# Altium schematic sheet CANInterface.SchDoc
size A4; SheetNumber: 3; SheetTotal: 9
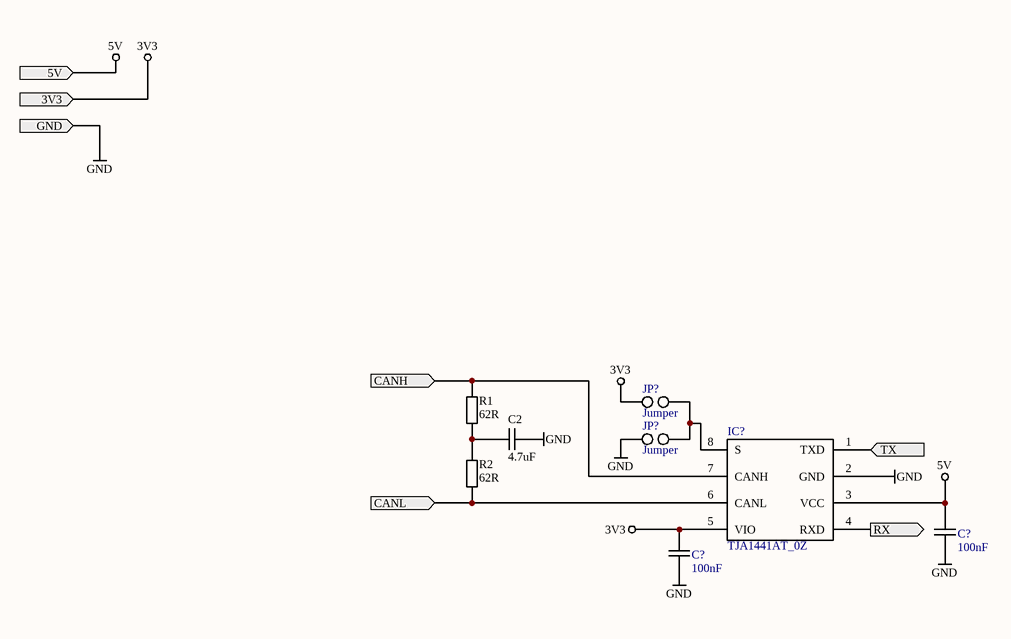
[diagram p0: CANInterface.SchDoc]

## Parts
(Parts that share a designator on the sheet are numbered #1, #2 ... from top to bottom, then left to right.)
C2  4.7uF  [C_1210]
C?#1  100nF  [C_0402]
C?#2  100nF  [C_0402]
IC?  TJA1441AT_0Z  [SOIC127P600X175-8N]
JP?#1  Jumper  [7731111802LF]
JP?#2  Jumper  [7731111802LF]
R1  62R  [R_1210]
R2  62R  [R_1210]

## Ports
3V3 (in), 5V (in), CANH (in), CANL (in), GND (in), RX (out), TX (in)

## Nets
3V3: C?#2.2 IC?.5(VIO) JP?#1.1 ; port 3V3
5V: C?#1.2 IC?.3(VCC) ; port 5V
GND: C2.2 C?#1.1 C?#2.1 IC?.2(GND) JP?#2.2 ; port GND
CANH: IC?.7(CANH) R1.2 ; port CANH
CANL: IC?.6(CANL) R2.1 ; port CANL
RX: IC?.4(RXD) ; port RX
TX: IC?.1(TXD) ; port TX
NetC2_1: C2.1 R1.1 R2.2
NetIC?_8: IC?.8(S) JP?#1.2 JP?#2.1

## Library data of the parts
C2 = GCJ32ER71H475KA12L: 4.7uF 50V X7R
C?#1 C?#2 = CGA2B3X7R1H104K050BE: 100nF 50V X7R
IC? = TJA1441AT_0Z: CAN Transciever; Manufacturer_Name: NXP; Manufacturer_Part_Number: TJA1441AT/0Z; Datasheet Link: https://www.mouser.it/datasheet/2/302/TJA1441-1949304.pdf; Height: 1.75mm; Mouser Part Number: 771-TJA1441AT/0Z; Mouser Price/Stock: https://www.mouser.co.uk/ProductDetail/NXP-Semiconductors/TJA1441AT-0Z?qs=eP2BKZSCXI7fcqmlBnmIFw%3D%3D; Arrow Part Number: TJA1441AT/0Z; Arrow Price/Stock: https://www.arrow.com/en/products/tja1441at0z/nxp-semiconductors?region=nac
JP?#1 JP?#2 = Jumper 2.45mm: 2.45mm Jumper; Manufacturer_Name: Amphenol; Manufacturer_Part_Number: 77311-118-02LF; Datasheet Link: https://cdn.amphenol-icc.com/media/wysiwyg/files/drawing/77311.pdf; Height: 8.94mm; Mouser Part Number: 649-77311-118-02LF; Mouser Price/Stock: https://www.mouser.co.uk/ProductDetail/Amphenol-FCI/77311-118-02LF?qs=5xI8GKdkXlmD4cdGgiyi7w%3D%3D; Arrow Part Number: 77311-118-02LF; Arrow Price/Stock: https://www.arrow.com/en/products/77311-118-02lf/amphenol-fci?region=europe
R1 R2 = ERJU14F62R0U: 62R 1% 500mW